# EAGLE design anet-esp8266-ext-mirrored (EAGLE 6.1)
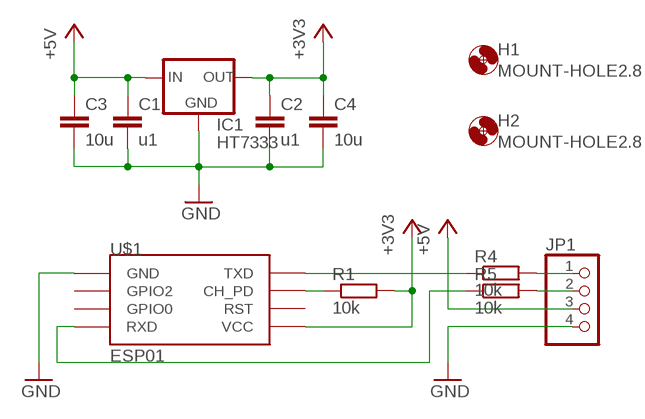
[diagram p0: schematic, sheet 1]

## Parts
C1  u1  C-EUC0805  [C0805]
C2  u1  C-EUC0805K  [C0805K]
C3  10u  C-EUC0805K  [C0805K]
C4  10u  C-EUC0805K  [C0805K]
H1  MOUNT-HOLE2.8  [2,8]
H2  MOUNT-HOLE2.8  [2,8]
IC1  HT7333  [SOT-89]
JP1  PINHD-1X4  [1X04]
R1  10k  R-EU_M0805  [M0805]
R4  10k  R-EU_R0805  [R0805]
R5  10k  R-EU_M0805  [M0805]
U$1  ESP01  [ESP01]

## Nets
+3V3: C2.1 C4.1 IC1.1(OUT) R1.2 U$1.VCC
+5V: C1.1 C3.1 IC1.3(IN) IC1.4(IN) JP1.3
GND: C1.2 C2.2 C3.2 C4.2 IC1.2(GND) JP1.4 U$1.GND
N$1: R1.1 U$1.CH_PD
N$2: JP1.1 R4.2
N$3: JP1.2 R5.2
RX: R5.1 U$1.RX(RXD)
TX: R4.1 U$1.TX(TXD)
Unconnected: U$1.GPIO0 U$1.GPIO2 U$1.RST

## Library data of the parts
C1-C4 = rcl:C-EU: CAPACITOR, European symbol
H1 H2 = holes:MOUNT-HOLE: MOUNTING HOLE with drill center marker
IC1 = holtek2:HT73*
JP1 = pinhead:PINHD-1X4: PIN HEADER
R1 R4 R5 = rcl:R-EU_: RESISTOR, European symbol
U$1 = esp8266modules:ESP01: ESP8266 Wifi module 01

## Board
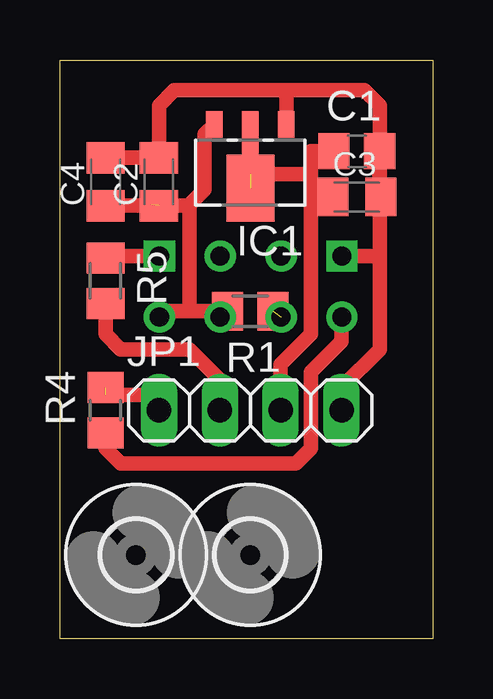
[diagram p1: board, top side]
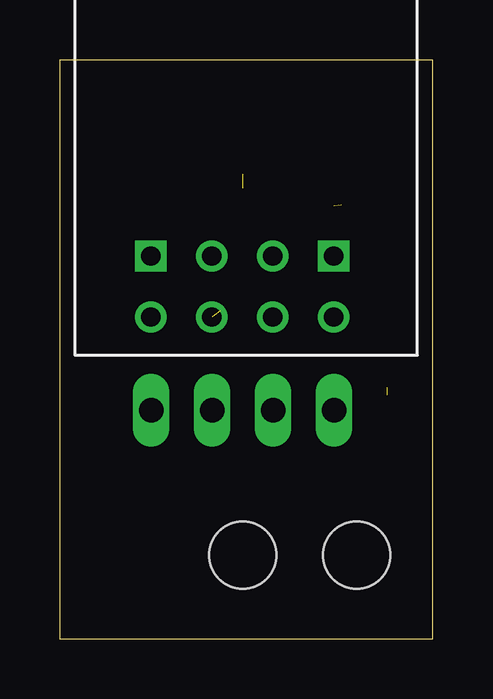
[diagram p2: board, bottom side, seen from below]

Size 15.56 x 24.13 mm. Coordinates in mm from the lower left corner, seen from the top.
Outline: 0,0 0,24.13 15.56,24.13 15.56,0 0,0
Copper layers (1*16): Top 0.035mm / dielectric 1.5mm / Bottom 0.035mm
Design rules: minimum track width 10mil, minimum drill 24mil, track to track 12mil, track to pad 12mil, pad to pad 12mil, via to via 12mil, smd to smd 10mil, copper to edge 12mil, drill to drill 12mil, minimum pad ring 10mil, minimum via ring 10mil, stop-mask expansion 4mil, vias tented up to drill 0mil, thermal gap 12mil

### Footprints (pad centres in the part's own frame; a part is rotated, then mirrored left to right if it is on the bottom)
C0805 = smd 1.3 x 1.5: 1 -0.95,0; 2 0.95,0
C0805K = smd 1.3 x 1.6: 1 -1,0; 2 1,0
2,8 = hole 2.8: 0,0
SOT-89 = smd 0.7 x 1.1: 1 1.5,-2.385; 2 -1.5,-2.385 | smd 0.7 x 1.8: 3 0,-2.035 | smd 2 x 2.8: 4 0,0.265
1X04 = drill 1.016 long: 1 -3.81,0; 2 -1.27,0; 3 1.27,0; 4 3.81,0
M0805 = smd 1.3 x 1.6: 1 -0.95,0; 2 0.95,0
R0805 = smd 1.3 x 1.5: 1 -0.95,0; 2 0.95,0
ESP01 = drill 0.8: CH_PD -1.285,-8.178; GPIO0 1.255,-5.638; GPIO2 -1.285,-5.638; RST 1.255,-8.178; TX -3.825,-8.178; VCC 3.795,-8.178 | drill 0.8 square: GND -3.825,-5.638; RX 3.795,-5.638

### Placement (x,y rotation side)
C1  12.38,20.32 0 top
C2  4.13,19.05 90 top
C3  12.38,18.41 0 top
C4  1.91,19.05 90 top
H1  3.17,3.49 0 top
H2  7.94,3.49 0 top
IC1  7.94,19.05 180 top
JP1  7.94,9.53 0 top
R1  7.94,13.65 180 top
R4  1.91,9.53 90 top
R5  1.91,14.92 270 top
U$1  7.94,21.59 0 bottom

### Tracks (layer width: path | path; a pad name or v marks a point on that pad's centre or on a via)
+3V3  (1 unrouted)
  Top 0.61: 6.75,13.41 R1.2 5.4,13.65 | U$1.VCC 4.38,13.65 5.4,13.65 | C4.1 3.76,18.05 3.81,18.1 | 5.4,13.65 5.4,18.1 | 5.4,18.1 6.03,18.73 6.03,21.03 IC1.1 | C2.1 5.35,18.05 5.4,18.1
+5V  (1 unrouted)
  Top 0.61: JP1.3 9.21,11.43 10.48,12.7 10.48,18.41 | 10.48,18.41 10.48,19.37 | 10.48,19.37 7.94,19.37 | IC1.4 IC1.3 | 10.48,19.37 10.48,20.32 C1.1 | C3.1 10.48,18.41
GND
  Top 0.61: JP1.4 11.75,10.48 13.34,12.06 13.34,15.88 | U$1.GND 13.26,15.95 13.34,15.88 | C4.2 C2.2 4.13,22.23 4.76,22.86 9.53,22.86 | 9.53,22.86 12.7,22.86 13.34,22.23 C1.2 | 13.34,15.88 C1.2 | IC1.2 9.44,22.77 9.53,22.86 | C1.2 13.33,18.46 C3.2
N$1  (1 unrouted)
N$2  (1 unrouted)
  Top 0.61: JP1.1 3.49,10.16 1.91,10.16
N$3
  Top 0.61: JP1.2 6.67,10.79 5.4,12.06 2.54,12.06 1.91,12.7 R5.2
RX
  Top 0.61: U$1.RX 1.99,15.95 R5.1
TX
  Top 0.61: R4.1 1.91,7.94 2.54,7.3 9.84,7.3 10.48,7.94 10.48,11.11 11.75,12.38 11.75,13.4 U$1.TX